# Altium schematic sheet radial_led_watch.SchDoc: nRF52832-CIAA Reference Layout (DCDC)
size A4; Revision: 1.0; SheetNumber: 1; SheetTotal: 1; DrawnBy: RUBR; DocumentSize: A4; PCAName: nRF52832-CIAA Reference Layout (DCDC)
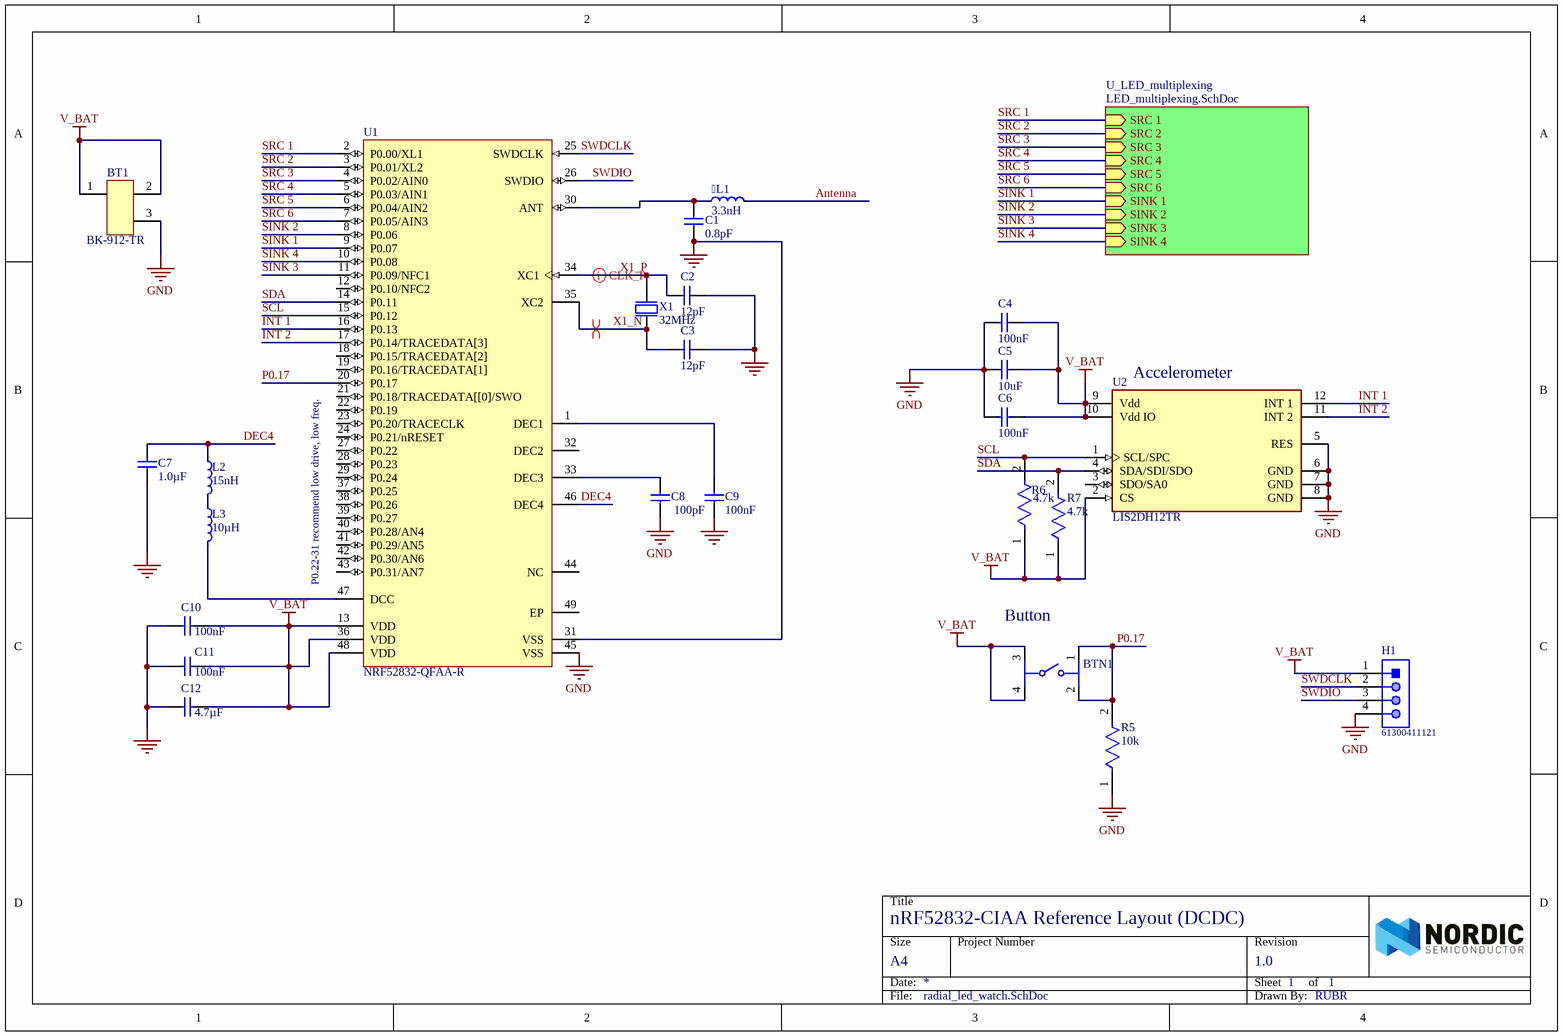
[diagram p0: radial_led_watch.SchDoc]

## Parts
L1  3.3nH  [INDC1005X04L]
BT1  BK-912-TR  [MPD-CN-DIN-3_V]
BTN1  PTS645SM43SMTR92LFS  [FP-PTS645SM43SMTR92LFS-MFG]  (value not drawn)
C1  0.8pF  [CAPC0603X03L]
C2  12pF  [CAPC0603X03L]
C3  12pF  [CAPC0603X03L]
C4  100nF  [CAPC0603X03L]
C5  10uF  [CAPC0603X03L]
C6  100nF  [CAPC0603X03L]
C7  1.0µF  [CAPC1005X04L]
C8  100pF  [CAPC0603X03L]
C9  100nF  [CAPC0603X03L]
C10  100nF  [CAPC0603X03L]
C11  100nF  [CAPC0603X03L]
C12  4.7µF  [CAPC1608X06L]
H1  61300411121  [61300411121]
L2  15nH  [INDC1005X04L]
L3  10µH  [INDC1608X06L]
R5  10k  [FP-CRCW0402-e3-IPC_C]
R6  4.7k  [FP-CRCW0402-e3-IPC_C]
R7  4.7k  [FP-CRCW0402-e3-IPC_C]
U1  NRF52832-QFAA-R  [NRSC-QF-48_M]
U2  LIS2DH12TR  [FP-LGA-12-8365767-MFG]
X1  32MHz  [BT-XTAL_2016]

## Sub-sheets
U_LED_multiplexing = LED_multiplexing.SchDoc: SRC 1 (in), SRC 2 (in), SRC 3 (in), SRC 4 (in), SRC 5 (in), SRC 6 (in), SINK 1 (in), SINK 2 (in), SINK 3 (in), SINK 4 (in)

## Nets
GND: BT1.3(NEGATIVE) C1.2 C2.2 C3.2 C4.2 C5.1 C6.1 C7.1 C8.1 C9.2 C10.2 C11.2 C12.1 H1.4 R5.1 U1.31(VSS) U1.45(VSS) U2.5(RES) U2.6(GND) U2.7(GND) U2.8(GND) X1.2(GND) X1.4(GND)
V_BAT: BT1.1(POSITIVE) BT1.2(POSITIVE) BTN1.3 BTN1.4 C4.1 C5.2 C6.2 C10.1 C11.1 C12.2 H1.1 R6.1 R7.1 U1.13(VDD) U1.36(VDD) U1.48(VDD) U2.2(CS) U2.9(Vdd) U2.10(Vdd_IO)
Antenna: L1.2
DEC4: C7.2 L2.1 U1.46(DEC4)
INT 1: U1.16(P0.13) U2.12(INT_1)
INT 2: U1.17(P0.14/TRACEDATA[3]) U2.11(INT_2)
P0.17: BTN1.1 BTN1.2 R5.2 U1.20(P0.17)
SCL: R6.2 U1.15(P0.12) U2.1(SCL/SPC)
SDA: R7.2 U1.14(P0.11) U2.4(SDA/SDI/SDO)
SINK 1: U1.9(P0.07) ; sheet U_LED_multiplexing/SINK 1
SINK 2: U1.8(P0.06) ; sheet U_LED_multiplexing/SINK 2
SINK 3: U1.11(P0.09/NFC1) ; sheet U_LED_multiplexing/SINK 3
SINK 4: U1.10(P0.08) ; sheet U_LED_multiplexing/SINK 4
SRC 1: U1.2(P0.00/XL1) ; sheet U_LED_multiplexing/SRC 1
SRC 2: U1.3(P0.01/XL2) ; sheet U_LED_multiplexing/SRC 2
SRC 3: U1.4(P0.02/AIN0) ; sheet U_LED_multiplexing/SRC 3
SRC 4: U1.5(P0.03/AIN1) ; sheet U_LED_multiplexing/SRC 4
SRC 5: U1.6(P0.04/AIN2) ; sheet U_LED_multiplexing/SRC 5
SRC 6: U1.7(P0.05/AIN3) ; sheet U_LED_multiplexing/SRC 6
SWDCLK: H1.2 U1.25(SWDCLK)
SWDIO: H1.3 U1.26(SWDIO)
X1_N: C3.1 U1.35(XC2) X1.3(out)
X1_P: C2.1 U1.34(XC1) X1.1(inp)
NetL1_1: L1.1 C1.1 U1.30(ANT)
NetC8_2: C8.2 U1.33(DEC3)
NetC9_1: C9.1 U1.1(DEC1)
NetL2_2: L2.2 L3.1
NetL3_2: L3.2 U1.47(DCC)

Not connected (* = marked no-connect by the designer): U1 12(P0.10/NFC2) 18(P0.15/TRACEDATA[2]) 19(P0.16/TRACEDATA[1]) 21(P0.18/TRACEDATA[[0]/SWO) 22(P0.19) 23(P0.20/TRACECLK) 24(P0.21/nRESET) 27(P0.22) 28(P0.23) 29(P0.24) 32(DEC2) 37(P0.25) 38(P0.26) 39(P0.27) 40(P0.28/AN4) 41(P0.29/AN5) 42(P0.30/AN6) 43(P0.31/AN7) 44(NC) 49(EP); U2 3(SDO/SA0)

## Layout directives
differential pair: X1_N, X1_P

## Notes on the sheet
- (near U2) Accelerometer
- (near U1) P0.22-31 recommend low drive, low freq.
- Button
- Title
- Size
- Date:
- Project Number
- Sheet         of
- Revision
- File:
- Drawn By:

## Library data of the parts
L1 L2 = IND_0402: High frequency chip inductor ±10%; Part Number: L0402-15n; Manufacturer: Taiyo Yuden; Manufacturer Part Number: HK100515NJ-T; 2nd source part number: 658-1328; Artikkelnr Noca: 33029323; Artikkelnr Simpro: N.A.; LatestRevisionDate: 2012-09-19; Pin Count: 2; Publisher: Nordic Semiconductor; Published: 2010-07-12; Note: High frequency chip inductor ±10%; Supplier: Digi-Key; Datasheet: http://www.yuden.co.jp/productdata/catalog/en/mlci04_e.pdf; Supplier part number: 587-1521-1-ND; 2nd source Supplier: Farnell; Footprint Doc: 0402
  L1: Value: 3.3nH
  L2: Value: 15nH
BT1 = CMP-0452-00001-3: Coin Cell Holder, 21.08 x 15.24 mm SMD; Manufacturer: Memory Protection Devices; Battery Series: 2032; Battery Type, Function: Coin Cell, Retainer; Number of Cells: 1; Mounting Technology: Surface Mount; Category: Battery Products; Family: Battery Holders, Clips, Contacts; PackageReference: CN-DIN-3; ComponentLink3URL: http://www.memoryprotectiondevices.com/datasheets/BK-912-datasheet.pdf; ComponentLink2Description: Datasheet; ComponentLink3Description: Package Specification; PackageDescription: 3-Pin, CN-DIN, Body 21.08x15.24mm; ComponentLink2URL: http://www.memoryprotectiondevices.com/datasheets/BK-912-datasheet.pdf; PartNumber: BK-912-TR; ComponentLink1URL: http://www.memoryprotectiondevices.com/; ComponentLink1Description: Manufacturer URL
BTN1 = CMP-2000-05160-2: SWITCH TACTILE SPST-NO 0.05A 12V; Contact Resistance: 100mR; Throw Configuration: SPST; Illumination Type: Non-Illuminated; Mechanical Life: 100000Cycles; Current Rating: 50mA; Switch Function: Off-Mom; Actuator Length: 0.85mm; Actuator Material: Nylon; Actuator Type: Standard; Operating Force: 160gf; Min Operating Temperature: -20°C; REACH SVHC: No SVHC; Termination: Gull Wing; Case/Package: SMD/SMT; Packaging: Tape and Reel; Mount: Surface Mount; Voltage Rating (DC): 12V; Orientation: Straight; Lead Free: Lead Free; Contact Material: Silver; Color: Black; Max Current Rating: 50mA; Contact Plating: Silver; Depth: 9mm; Package Quantity: 1; Max Voltage Rating (DC): 12V; Length: 6mm; Max Operating Temperature: 60°C
C1-C3 C5 C6 = CAP_0201: Capacitor, NP0, ±5%; Part Number: C0201-TBD; Note: Chip Cap; Artikkelnr Noca: N.A.; Manufacturer: *; Manufacturer Part Number: *; Datasheet: *; Footprint Doc: 0201; LatestRevisionDate: 2014-11-13; Pin Count: 2; Publisher: Nordic Semiconductor; Published: 2014-11-13; Supplier: *; Supplier part number: *; 2nd source Supplier: *; 2nd source part number: *; Artikkelnr Simpro: N.A.
  C1: Value: 0.8pF
  C2 C3: Value: 12pF
  C5: Value: 10uF
  C6: Value: 100nF
C4 C8-C11 = CAP_0201: Capacitor, NP0, ±5%; Part Number: C0201-TBD; Value: TBD; Note: Chip Cap; Artikkelnr Noca: N.A.; Manufacturer: *; Manufacturer Part Number: *; Datasheet: *; LatestRevisionDate: 2014-11-13; Pin Count: 2; Publisher: Nordic Semiconductor; Published: 2014-11-13; Supplier: *; Supplier part number: *; 2nd source Supplier: *; 2nd source part number: *; Footprint Doc: 0201; Artikkelnr Simpro: N.A.
C7 = CAP_0402: Capacitor, X5R, ±5%; Part Number: C0402-1µ0; Note: 6.3V; Artikkelnr Noca: 20039235; Artikkelnr Simpro: N.A.; Manufacturer: *; Manufacturer Part Number: *; Datasheet: *; LatestRevisionDate: 2009-11-23; Pin Count: 2; Publisher: Nordic Semiconductor; Published: 2009-05-08; Value: 1.0µF; Supplier: *; Supplier part number: *; 2nd source Supplier: *; 2nd source part number: *; Footprint Doc: 0402
C12 = CAP_0603: Capacitor, X5R, ±10%; Part Number: C0603-4µ7; Note: 6.3V; Artikkelnr Noca: 20069060; Artikkelnr Simpro: N.A.; Manufacturer: *; Manufacturer Part Number: *; Datasheet: *; LatestRevisionDate: 2009-11-23; Pin Count: 2; Publisher: Nordic Semiconductor; Published: 2009-05-08; Value: 4.7µF; Supplier: *; Supplier part number: *; 2nd source Supplier: *; 2nd source part number: *; Footprint Doc: 0603
H1 = CMP-1502-01064-1: THT Vertical Pin Header WR-PHD, Pitch 2.54 mm, Single Row, 4 pins; Manufacturer: Wurth Elektronik; Withstanding Voltage: 500VAC; Rated Current: 3A; Working Voltage: 250VAC; Pin Number: 4; Gender: Male; Contact Resistance: 20mOhm; Pitch: 2.54mm; Manufacturer URL: http://www.we-online.de; Operating Temperature: -40to105degC; Packaging: Bag; Mounting Technology: THT; Package Reference: 61300411121; Datasheet URL: https://katalog.we-online.de/em/datasheet/6130xx11121.pdf; Publisher: WurthElektronik; Part Number: 61300411121; Row Number: Single; Orientation: Vertical
L3 = IND_0603: Chip inductor, IDC,min = 50 mA, ±20%; Part Number: L0603-10µ; Manufacturer: Taiyo Yuden; Manufacturer Part Number: LBMF1608T100K; 2nd source part number: 178-6105; Note: LBMF1608T100K 10µH 80mA 0603; Artikkelnr Noca: 33029314; Artikkelnr Simpro: N.A.; Datasheet: http://www.yuden.co.jp/ut/product/pdf/elb2_e.pdf; LatestRevisionDate: 2012-09-19; Pin Count: 2; Publisher: Nordic Semiconductor; Published: 2010-02-24; Value: 10µH; Supplier: Digi-Key; Supplier part number: 587-1714-1-ND; 2nd source Supplier: Farnell; Footprint Doc: 0603
R5-R7 = CMP-2002-08122-2: RES Thick Film, 0Ω, 0.063W, 0402; Tolerance: 5%; Max Power Dissipation: 63mW; Voltage Rating: 50V; Temperature Coefficient: 100ppm/°C; Resistance: 0mR; Contact Plating: Tin; Height: 0.35mm; Radiation Hardening: No; Features: Automotive AEC-Q200; Composition: Thick Film; Width: 0.5mm; Weight: 2.3E-05oz; Termination: SMD/SMT; Packaging: Tape and Reel; Mount: Surface Mount; Case Code (Metric): 1005; Military Standard: Not; Min Operating Temperature: -55°C; Number of Terminations: 2; Package Quantity: 1; Case Code (Imperial): 0402; Depth: 0.5mm; Max Operating Temperature: 155°C; Case/Package: 0402; Power Rating: 63mW; Lead Free: Lead Free; Voltage Rating (DC): 50V; Length: 1mm
U1 = CMP-2100-03661-1: Multiprotocol Bluetooth Smart, ANT/ANT+ and Proprietary System-on-Chip, 2.4 GHz, 256 KB FLASH, 1.7 to 3.6 V, -40 to 85 degC, 48-Pin QFN, RoHS, Tape and Reel; Manufacturer: Nordic Semiconductor; Frequency: 2.4GHz; Datasheet Version: Rev. 1.0, 02/2016; Datasheet URL: http://infocenter.nordicsemi.com/pdf/nRF52832_PS_v1.0.pdf; Mount: SurfaceMount; Max Operating Temperature: 85degC; Manufacturer URL: http://www.nordicsemi.com/eng/Products/; Lead Free: LeadFree; Min Operating Temperature: -40degC; RoHSCompliant: true; Package Reference: QF-48; Package Description: 48-Pin Quad Flat No-lead Package, Body 6 x 6 mm, Pitch 0.4 mm, Thermal Pad 4.6 x 4.6 mm; Max Frequency: 2.4GHz; Packaging: TapeandReel
U2 = CMP-2000-05369-2: ACCEL 2-16G I2C/SPI 12LGA; Output Type: SPI; Axis: X, Y, Z; Interface: I2C; Max Supply Voltage: 3.6V; Bandwidth: 672Hz; Min Supply Voltage: 1.71V; Min Operating Temperature: -40°C; Width: 2.15mm; Lead Free: Lead Free; Case/Package: LGA; Contact Plating: Gold; Number of Pins: 12; Max Operating Temperature: 85°C; Packaging: Cut Tape; Radiation Hardening: No; Length: 2.15mm; REACH SVHC: No SVHC; Height: 1mm; Mount: Surface Mount
X1 = XTAL_SMD2016: XTAL SMD 2016, 32MHz, Cl=8pF, Total Tol: ±40ppm; Part Number: XTAL_SMD2016_32MHz_8pF_Epson; Manufacturer: Epson Toyocom; Manufacturer Part Number: Q22FA12800025; Note: XTAL SMD 32.000MHz; Artikkelnr Noca: N.A.; Datasheet: http://www.epsondevice.com/docs/qd/en/DownloadServlet?id=ID000449; LatestRevisionDate: 2014-11-27; Pin Count: 4; Publisher: Nordic Semiconductor; Published: 2012-03-09; Value: 32MHz; Supplier: Farnell; Supplier part number: 171-2806; 2nd source Supplier: *; 2nd source part number: *; Footprint Doc: XTAL_2016; Artikkelnr Simpro: N.A.